# Altium schematic sheet manilla.SchDoc
size A4; SheetNumber: 1; SheetTotal: 5
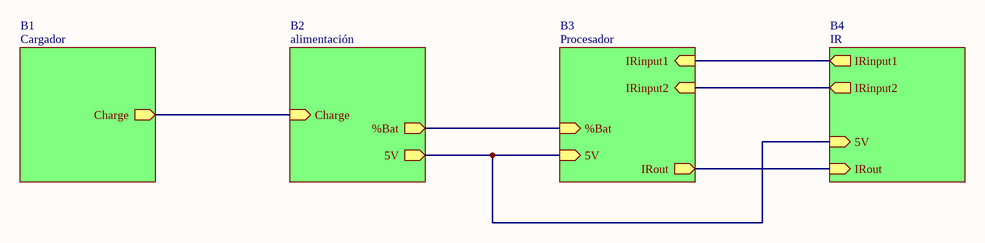
[diagram p0: manilla.SchDoc]

## Sub-sheets
B1 = Cargador: Charge (out)
B2 = alimentación: 5V (out), %Bat (out), Charge (in)
B3 = Procesador: %Bat (in), 5V (in), IRout (out), IRinput1 (in), IRinput2 (in)
B4 = IR: 5V (in), IRout (in), IRinput1 (out), IRinput2 (out)

## Nets
(unnamed): sheet B2/5V, sheet B3/5V, sheet B4/5V
(unnamed): sheet B2/%Bat, sheet B3/%Bat
(unnamed): sheet B2/Charge, sheet B1/Charge
(unnamed): sheet B3/IRout, sheet B4/IRout
(unnamed): sheet B3/IRinput1, sheet B4/IRinput1
(unnamed): sheet B3/IRinput2, sheet B4/IRinput2